# EAGLE design ELEKTRA-PMIC v0.2-Half frame shield for astellated edges adjacent-35X22 (EAGLE 9.6.2)

## Sheet 1 of 2
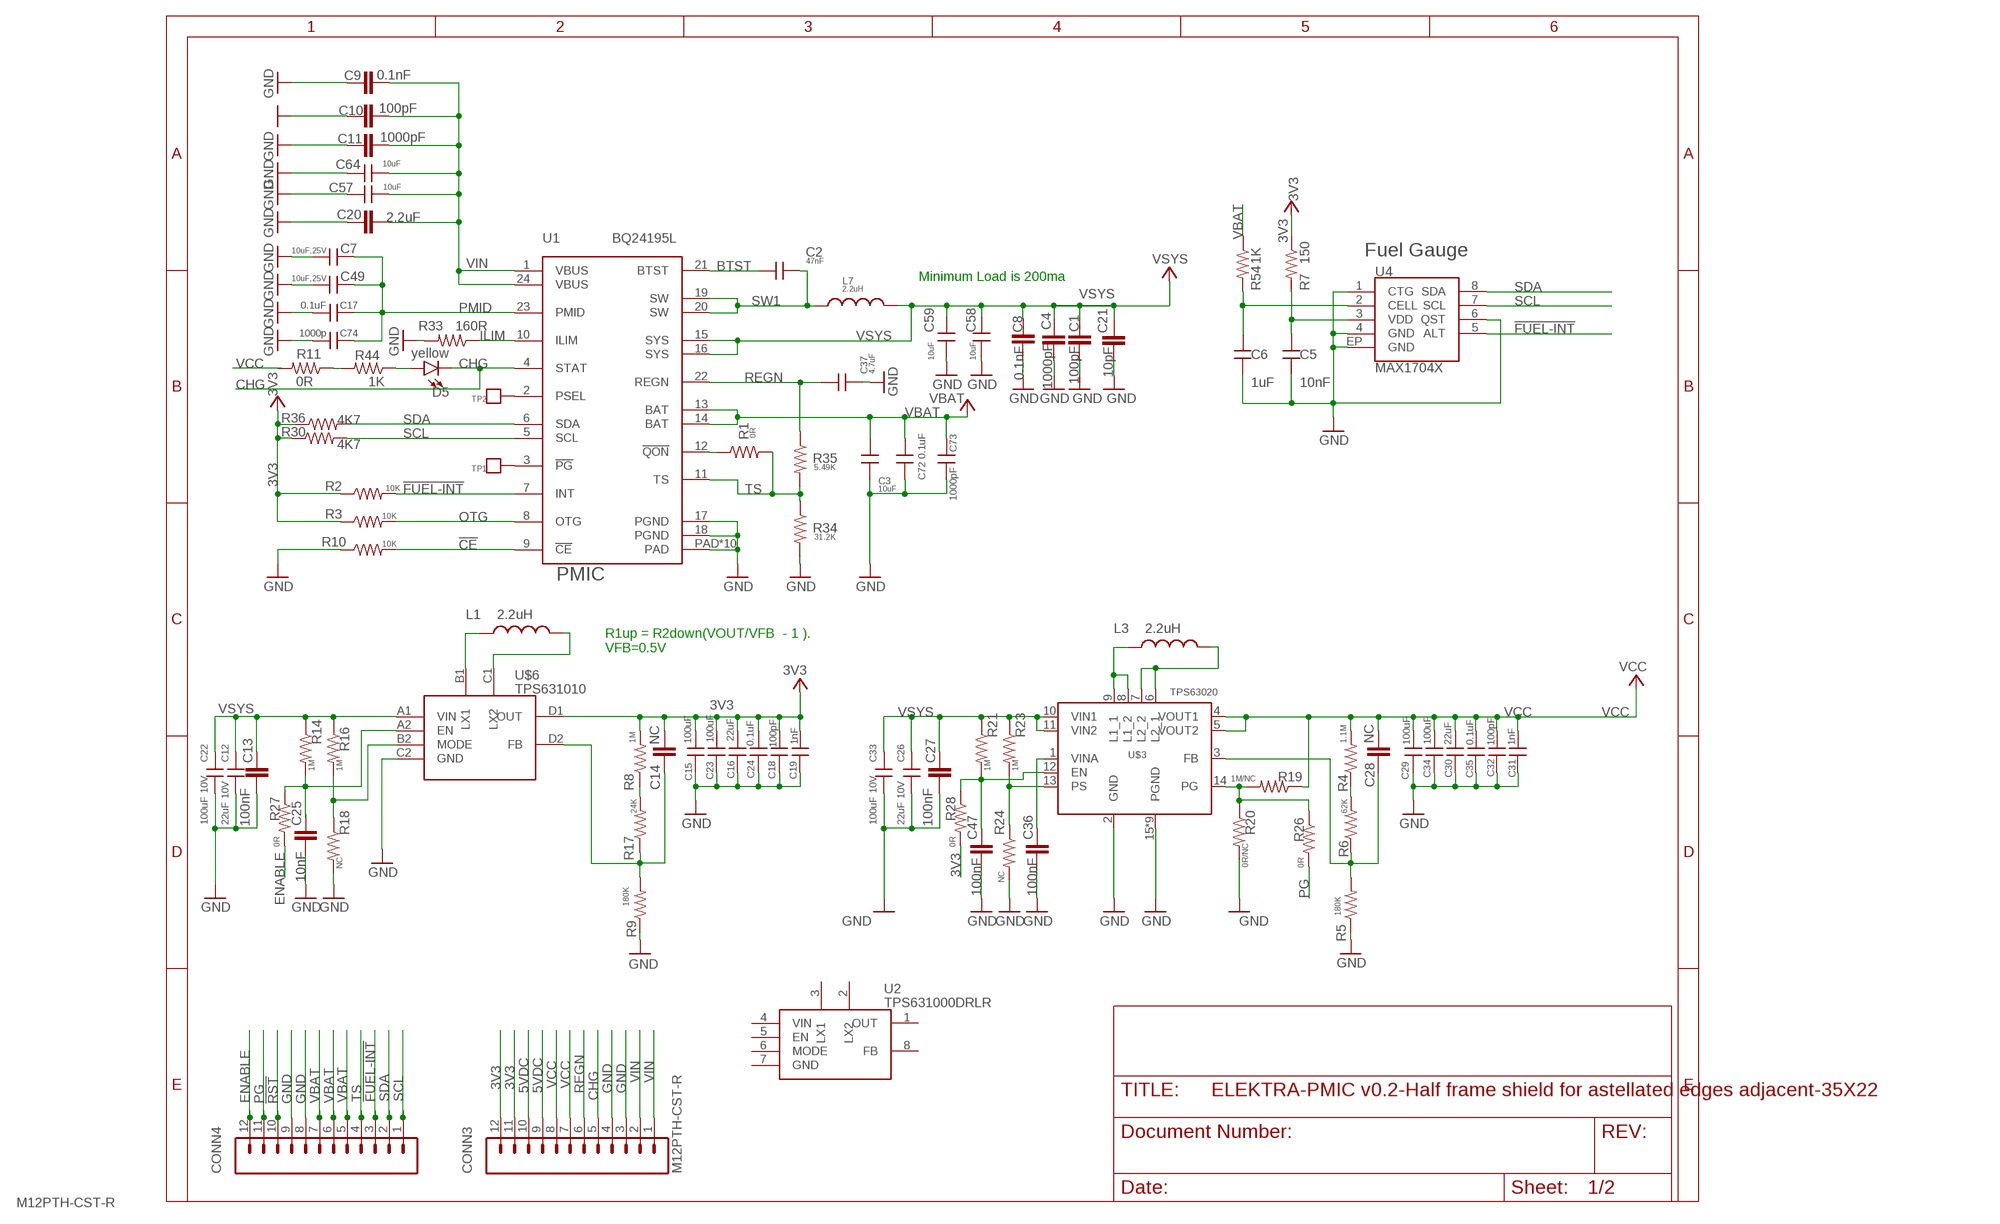
[diagram p0: schematic, sheet 1]

### Parts
C1  100pF  CAP_1  [C0402_B]
C2  47nF  CAP0402  [C-0402]
C3  10uF  CAPC0603  [C0603]
C4  1000pF  CAP_1  [C0402_B]
C5  10nF  CAP0402A  [C0402]
C6  1uF  CAP0402A  [C0402]
C7  10uF,25V  CAP0603A  [C-0603A]
C8  0.1nF  CAP_1  [C0402_B]
C9  0.1nF  CAP_1  [C0402_B]
C10  100pF  CAP_1  [C0402_B]
C11  1000pF  CAP_1  [C0402_B]
C12  22uF 10V  CAPC0805  [C0805]
C13  100nF  CAP_1  [C0402_B]
C14  NC  CAP_1  [C0402_B]
C15  100uF  CAPC1206  [C1206]
C16  22uF  CAP0603A  [C-0603A]
C17  0.1uF  CAP0402A  [C0402]
C18  100pF  CAP0402A  [C0402]
C19  1nF  CAP0402A  [C0402]
C20  2.2uF  CAP_1  [C0402_B]
C21  10pF  CAP_1  [C0402_B]
C22  100uF 10V  CAPC1206  [C1206]
C23  100uF  CAPC1206  [C1206]
C24  0.1uF  CAP0402A  [C0402]
C25  10nF  CAP_1  [C0402_B]
C26  22uF 10V  CAPC0805  [C0805]
C27  100nF  CAP_1  [C0402_B]
C28  NC  CAP_1  [C0402_B]
C29  100uF  CAPC1206  [C1206]
C30  22uF  CAP0603A  [C-0603A]
C31  1nF  CAP0402A  [C0402]
C32  100pF  CAP0402A  [C0402]
C33  100uF 10V  CAPC1206  [C1206]
C34  100uF  CAPC1206  [C1206]
C35  0.1uF  CAP0402A  [C0402]
C36  100nF  CAP_1  [C0402_B]
C37  4.7uF  CAP0402A  [C0402]
C47  100nF  CAP_1  [C0402_B]
C49  10uF,25V  CAP0603A  [C-0603A]
C57  10uF  CAP0603A  [C-0603A]
C58  10uF  CAP0603A  [C-0603A]
C59  10uF  CAP0603A  [C-0603A]
C64  10uF  CAP0603A  [C-0603A]
C72  0.1uF  CAP0402  [C-0402]
C73  1000pF  CAP0402  [C-0402]
C74  1000p  CAP0402  [C-0402]
CONN3  M12PTH-CST-R  [1X12-CASTELLATED]
CONN4  M12PTH-CST-R  [1X12-CASTELLATED]
D5  yellow  LED-RED0603  [LED-0603]
L1  2.2uH  INDUCTOR-SPARKFUNVLS3012ET-4R7M  [INDUCTOR-VLS-E]
L3  2.2uH  INDUCTOR-SPARKFUNVLS3012ET-4R7M  [INDUCTOR-VLS-E]
L7  2.2uH  INDUCTORI  [INDUCTOR-4040]
R1  0R  R-US_  [R0402_B]
R2  10K  R-US_  [R0402_B]
R3  10K  R-US_  [R0402_B]
R4  1.1M  R-US_  [R0402_B]
R5  180K  R-US_  [R0402_B]
R6  62K  R-US_  [R0402_B]
R7  150  R-US_  [R0402_B]
R8  1M  R-US_  [R0402_B]
R9  180K  R-US_  [R0402_B]
R10  10K  R-US_  [R0402_B]
R11  0R  R-US_  [R0402_B]
R14  1M  R-US_  [R0402_B]
R16  1M  R-US_  [R0402_B]
R17  24K  R-US_  [R0402_B]
R18  NC  R-US_  [R0402_B]
R19  1M/NC  R-US_  [R0402_B]
R20  0R/NC  R-US_  [R0402_B]
R21  1M  R-US_  [R0402_B]
R23  1M  R-US_  [R0402_B]
R24  NC  R-US_  [R0402_B]
R26  0R  R-US_  [R0402_B]
R27  0R  R-US_  [R0402_B]
R28  0R  R-US_  [R0402_B]
R30  4K7  R-US_  [R0402_B]
R33  160R  R-US_  [R0402_B]
R34  31.2K  R-US_  [R0402_B]
R35  5.49K  R-US_  [R0402_B]
R36  4K7  R-US_  [R0402_B]
R44  1K  R-US_  [R0402_B]
R54  1K  R-US_  [R0402_B]
TP1  TP  [TP0.7MM]
TP2  TP  [TP0.7MM]
U1  BQ24195L  BQ24298RTWR  [QFN24]
U2  TPS631000DRLR  [SOT538]
U4  MAX1704X  [TDFN-8]
U$3  TPS63020  [TPS63020]
U$6  TPS631010  [DSBGA]

### Nets
3V3: C14.2 C15.1 C16.1 C18.1 C19.1 C23.1 C24.1 CONN3.11 CONN3.12 R2.1 R3.1 R7.1 R8.2 R28.2 R30.1 R36.1 U$6.D1(OUT)
5VDC: CONN3.9 CONN3.10
!CE: R10.2 U1.9(!CE)
!FUEL-INT: CONN4.3 R2.2 U1.7(INT) U4.5(ALT)
!RST: CONN4.10
BTST: C2.1 U1.21(BTST)
CHG: CONN3.5 D5.C U1.4(STAT)
ENABLE: CONN4.12 R27.2
GND: C1.1 C3.2 C4.1 C5.2 C6.2 C7.2 C8.1 C9.1 C10.1 C11.1 C12.2 C13.1 C15.2 C16.2 C17.1 C18.2 C19.2 C20.1 C21.1 C22.2 C23.2 C24.2 C25.1 C26.2 C27.1 C29.2 C30.2 C31.2 C32.2 C33.2 C34.2 C35.2 C36.1 C37.2 C47.1 C49.2 C57.2 C58.2 C59.2 C64.2 C72.2 C73.2 C74.1 CONN3.3 CONN3.4 CONN4.8 CONN4.9 R5.1 R9.1 R10.1 R18.2 R20.2 R24.2 R33.2 R34.2 U1.17(PGND) U1.18(PGND) U1.PAD U1.PAD@1(PAD) U1.PAD@2(PAD) U1.PAD@3(PAD) U1.PAD@4(PAD) U1.PAD@5(PAD) U1.PAD@6(PAD) U1.PAD@7(PAD) U1.PAD@8(PAD) U1.PAD@9(PAD) U4.1(CTG) U4.4(GND) U4.6(QST) U4.EP(GND) U$3.2(GND) U$3.15(PGND) U$3.16(PGND) U$3.17(PGND) U$3.18(PGND) U$3.19(PGND) U$3.20(PGND) U$3.21(PGND) U$3.22(PGND) U$3.23(PGND) U$6.C2(GND)
ILIM: R33.1 U1.10(ILIM)
N$1: R1.1 U1.12(!QON)
N$2: R11.1 R44.2
N$3: D5.A R44.1
N$4: TP1.P$1 U1.3(!PG)
N$5: C14.1 R9.2 R17.1 U$6.D2(FB)
N$6: C28.1 R5.2 R6.1 U$3.3(FB)
N$7: TP2.P$1 U1.2(PSEL)
N$8: R8.1 R17.2
N$9: R4.1 R6.2
N$11: L3.P$1 U$3.8(L1_2) U$3.9(L1_1)
N$12: L1.P$1 U$6.B1(LX1)
N$14: C25.2 R14.2 R27.1 U$6.A2(EN)
N$15: R16.2 R18.1 U$6.B2(MODE)
N$16: L3.P$2 U$3.6(L2_1) U$3.7(L2_2)
N$17: L1.P$2 U$6.C1(LX2)
N$19: C36.2 U$3.1(VINA)
N$20: R19.2 R20.1 R26.1 U$3.14(PG)
N$21: C47.2 R21.2 R28.1 U$3.12(EN)
N$22: R23.2 R24.1 U$3.13(PS)
N$48: C5.1 R7.2 U4.3(VDD)
N$49: C6.1 R54.2 U4.2(CELL)
OTG: R3.2 U1.8(OTG)
PG: CONN4.11 R26.2
PMID: C7.1 C17.2 C49.1 C74.2 U1.23(PMID)
REGN: C37.1 CONN3.6 R35.1 U1.22(REGN)
SCL: CONN4.1 R30.2 U1.5(SCL) U4.7(SCL)
SDA: CONN4.2 R36.2 U1.6(SDA) U4.8(SDA)
SW1: C2.2 L7.P$1 U1.19(SW) U1.20(SW)
TS: CONN4.4 R1.2 R34.1 R35.2 U1.11(TS)
VBAT: C3.1 C72.1 C73.1 CONN4.5 CONN4.6 CONN4.7 R54.1 U1.13(BAT) U1.14(BAT)
VCC: C28.2 C29.1 C30.1 C31.1 C32.1 C34.1 C35.1 CONN3.7 CONN3.8 R4.2 R11.2 R19.1 U$3.4(VOUT1) U$3.5(VOUT2)
VIN: C9.2 C10.2 C11.2 C20.2 C57.1 C64.1 CONN3.1 CONN3.2 U1.1(VBUS) U1.24(VBUS)
VSYS: C1.2 C4.2 C8.2 C12.1 C13.2 C21.2 C22.1 C26.1 C27.2 C33.1 C58.1 C59.1 L7.P$2 R14.1 R16.1 R21.1 R23.1 U1.15(SYS) U1.16(SYS) U$3.10(VIN1) U$3.11(VIN2) U$6.A1(VIN)
Unconnected: U2.1(OUT) U2.2(LX2) U2.3(LX1) U2.4(VIN) U2.5(EN) U2.6(MODE) U2.7(GND) U2.8(FB)

### Notes on the sheet
- Fuel Gauge
- Minimum Load is 200ma
- PMIC
- R1up = R2down(VOUT/VFB  - 1 ).
  VFB=0.5V

## Sheet 2 of 2

## Library data of the parts
C1 = Particle:CAP_1; ITEM_NAME: CAP CER 100pF 50V X7R 0402 10%; ITEM_NUMBER: PT-200138
C2 = particle SZ:CAP: CAP; ITEM_NAME: CAP CER 0.1uF 16V X7R 0402 10%; ITEM_NUMBER: PT-200005
C3 C37 C58 C59 = particle SZ:CAP: CAP; ITEM_NAME: CAP CER 10uF 6.3V X5R 0603 10% Low ESR<70mohms; ITEM_NUMBER: PT-200209
C4 = Particle:CAP_1; ITEM_NAME: CAP CER 1000PF 50V X7R 0402 10%
C5 = particle SZ:CAP: CAP; ITEM_NAME: CAP CER 10nF 16V X5R 0402 10%; ITEM_NUMBER: PT-200136
C6 = particle SZ:CAP: CAP; ITEM_NAME: CAP CER X5R 1uF 0402 10V ±10% ROHS; ITEM_NUMBER: PT-200695
C7 C49 C57 C64 = particle SZ:CAP: CAP; ITEM_NAME: CAP CER 100PF 50V C0G/NP0 0603 5%; ITEM_NUMBER: PT-200458
C8 C13 C27 = Particle:CAP_1; ITEM_NAME: CAP CER 0.1UF 16V X7R 0402 10%; ITEM_NUMBER: PT-200649
C9 = Particle:CAP_1; ITEM_NAME: CAP CER 0.1UF 25V X7R 0402 20%; ITEM_NUMBER: PT-200690
C10 = Particle:CAP_1; ITEM_NAME: CAP CER 100PF 1% 50V C0G/NP0 0402; ITEM_NUMBER: 120-00051
C11 = Particle:CAP_1; ITEM_NAME: CAP CER 1000PF 50V X7R 0402 10%; ITEM_NUMBER: PT-200631
C12 C26 = particle SZ:CAP: CAP; ITEM_NAME: CAP CER 0.1UF 16V X7R 0402 10%; ITEM_NUMBER: 120-00060
C14 C25 C28 C36 C47 = Particle:CAP_1
C15 C23 C29 C34 = particle SZ:CAP: CAP; ITEM_NAME: 100UF 20% 6.3V 1206, Low DCL, ESR 0.5Ohm; ITEM_NUMBER: 120-00011
C16 C30 = particle SZ:CAP: CAP; ITEM_NAME: CAP CER 22UF 10V X5R 0603 20%; ITEM_NUMBER: 120-00061
C17 = RedBear:CAP: CAP; ITEM_NAME: CAP CER 0.1UF 25V X7R 0402 20%; ITEM_NUMBER: PT-200690
C18 C32 = particle SZ:CAP: CAP; ITEM_NAME: 100pF 50V X7R 0402 10%; ITEM_NUMBER: PT-200138
C19 C31 C73 = particle SZ:CAP: CAP; ITEM_NAME: 1000PF 50V X7R 0402 10%; ITEM_NUMBER: PT-200631
C20 = Particle:CAP_1; ITEM_NAME: CAP CER 2.2UF 25V X7S 0603; ITEM_NUMBER: PT-201241
C21 = Particle:CAP_1; ITEM_NAME: CAP CER 10PF 5% 50V C0G/NP0 0402; ITEM_NUMBER: 120-00038
C22 C33 = particle SZ:CAP: CAP
C24 C35 = particle SZ:CAP: CAP; ITEM_NAME: 0.1UF 16V X7R 0402 10%; ITEM_NUMBER: PT-200649
C72 = particle SZ:CAP: CAP; ITEM_NAME: CAP CER 0.1UF 16V X7R 0402 10%; ITEM_NUMBER: PT-200649
C74 = particle SZ:CAP: CAP; ITEM_NAME: CAP CER 1000PF 50V X7R 0402 10%; ITEM_NUMBER: PT-200631
CONN3 CONN4 = Particle:M12: Header 12 Standard 12-pin 0.1" header. Use with straight break away headers (SKU : PRT-00116), right angle break away headers (PRT-00553), swiss pins (PRT-00743), machine pins (PRT-00117), and female headers (PRT-00115).
D5 = SparkFun-LED:LED-RED: Red SMD LED Used in manufacturing of most products at SparkFun Packages: 0603 - SMD 0603 package [Product Link] <http://docs.avagotech.com/docs/AV02-0551EN> 0603 SMART - SMD 0603 SMART package ( more efficient and expensive)[Product Link] <http://www.osram-os.com/Graphics/XPic2/00077099_0.pdf> 1206 - SMD1206 package [Product Link] <https://www.sparkfun.com/datasheets/DevTools/LilyPad/Q150OVS4.pdff> SparkFun Products: Pro Mini 328 -5V <https://www.sparkfun.com/products/821> RedBoard <https://www.sparkfun.com/products/12757> IOIO-OTG <https://www.sparkfun.com/products/13613>; PROD_ID: DIO-00819; VALUE: RED
L1 L3 = Particle:INDUCTOR-SPARKFUN: Inductors Basic Inductor/Choke - 0603 and 1206. Footprints are not proven and vary greatly between part numbers. SRN6045- 33uH, 20% 1.4A
L7 = Particle:INDUCTOR; ITEM_NAME: FIXED IND 1UH 5.8A 26 MOHM SMD 4020; ITEM_NUMBER: 155-00005
R1 R26 = Spark:R-US_: 0402 Resistor; ITEM_NAME: RES SMD 0R OHM 5% 1/16W 0402; ITEM_NUMBER: PT-200624
R2 R3 R10 = Spark:R-US_: 0402 Resistor; ITEM_NAME: 10K OHM 5% 1/16W 0402; ITEM_NUMBER: PT-200004
R4-R6 R9 R18-R20 R24 R27 R28 R34 R35 = Spark:R-US_: 0402 Resistor
R7 R33 = Particle:R-US_: 0402 Resistor
R8 R14 R16 R21 R23 = Spark:R-US_: 0402 Resistor; ITEM_NAME: RES SMD 1M OHM 1% 1/16W 0402; ITEM_NUMBER: PT-201084
R11 = Particle:R-US_: 0402 Resistor; ITEM_NAME: RES SMD 0R OHM 5% 1/16W 0402; ITEM_NUMBER: PT-200624
R17 = Spark:R-US_: 0402 Resistor; ITEM_NAME: RES SMD 24K OHM 1% 1/16W 0402; ITEM_NUMBER: PT-201025
R30 R36 = Particle:R-US_: 0402 Resistor; ITEM_NAME: RES SMD 4K7 OHM 5% 1/16W 0402; ITEM_NUMBER: PT-200230
R44 R54 = Particle:R-US_: 0402 Resistor; ITEM_NAME: RES SMD 1K OHM 5% 1/16W 0402; ITEM_NUMBER: PT-200002
TP1 TP2 = Asset Tracker SoM v1.0b:TP
U1 = electron:BQ24298RTWR: Bq24298 I2C Controlled 3A Single Cell USB Charger with Narrow VDC Power Path Management and Adjustable Voltage USB OTG; ITEM_NAME: IC BATT CHG LI-ION 1CELL 24VQFN 2.5A CHG CURRENT; ITEM_NUMBER: 150-00013
U2 = particle SZ:TPS631000DRLR
U4 = SparkFun-PowerIC:MAX1704X: MAX17043/MAX17044: Battery Fuel Guage (43 is 1cell, 44 is 2cell); ITEM_NAME: IC 2-WIRE FG MODEL GAUGE LO BATT; ITEM_NUMBER: PT-200141
U$3 = particle SZ:TPS63020
U$6 = particle SZ:TPS631010

## Net classes
0 default: width 0.152 mm, drill 0.203 mm, clearance 0.152 mm
1 power: width 0.254 mm, drill 0.203 mm, clearance 0.203 mm
3 BAT: drill 0.203 mm, clearance 0.203 mm
4 3V3: width 0.305 mm, drill 0.203 mm, clearance 0.508 mm
6 +3V3: width 0.203 mm, drill 0.203 mm, clearance 0.152 mm

## Board
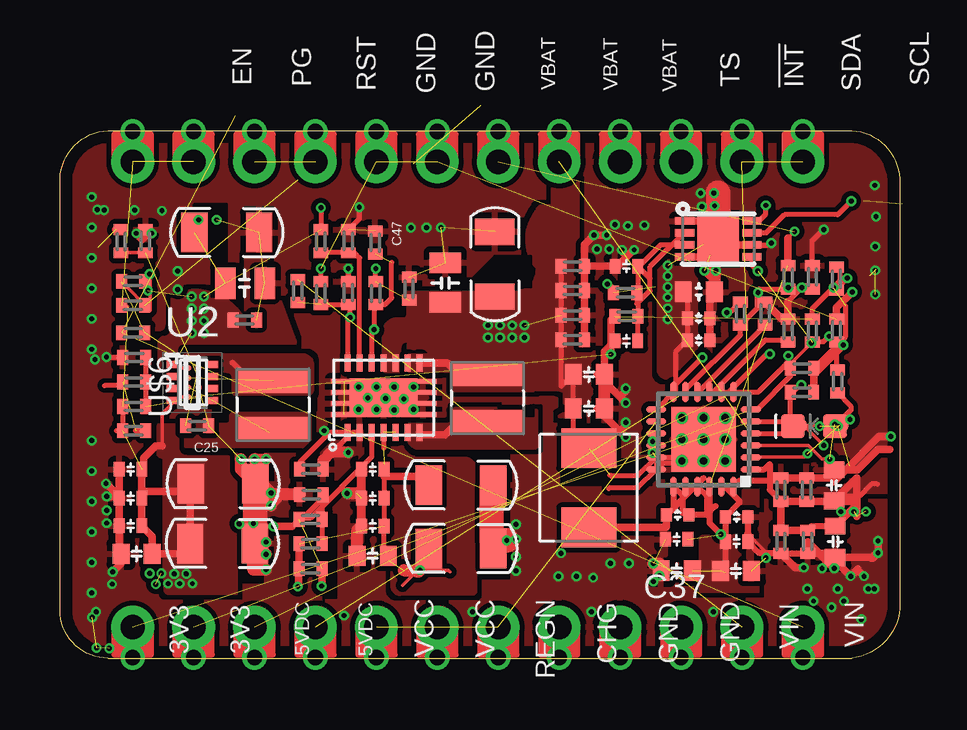
[diagram p1: board, top side]
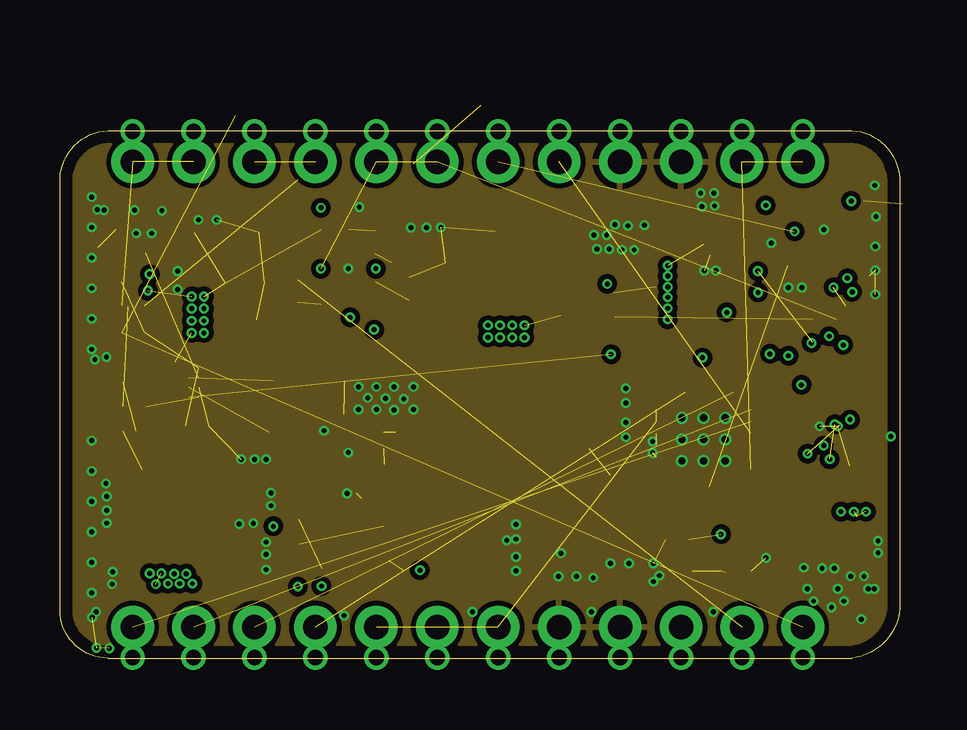
[diagram p2: board, inner layer Route2]
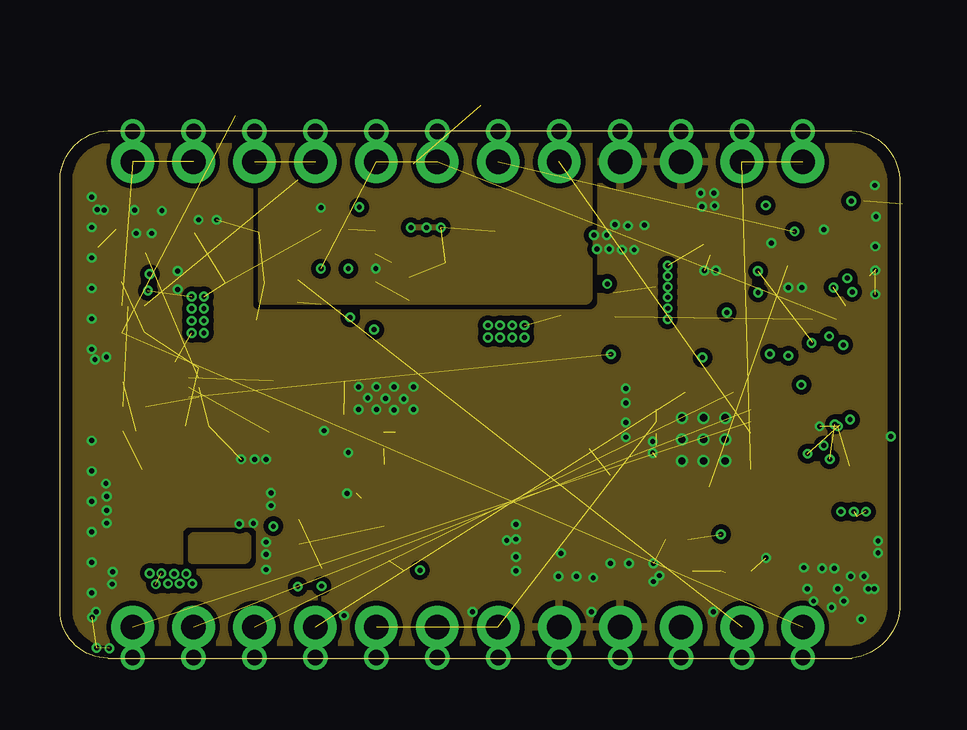
[diagram p3: board, inner layer Route15]
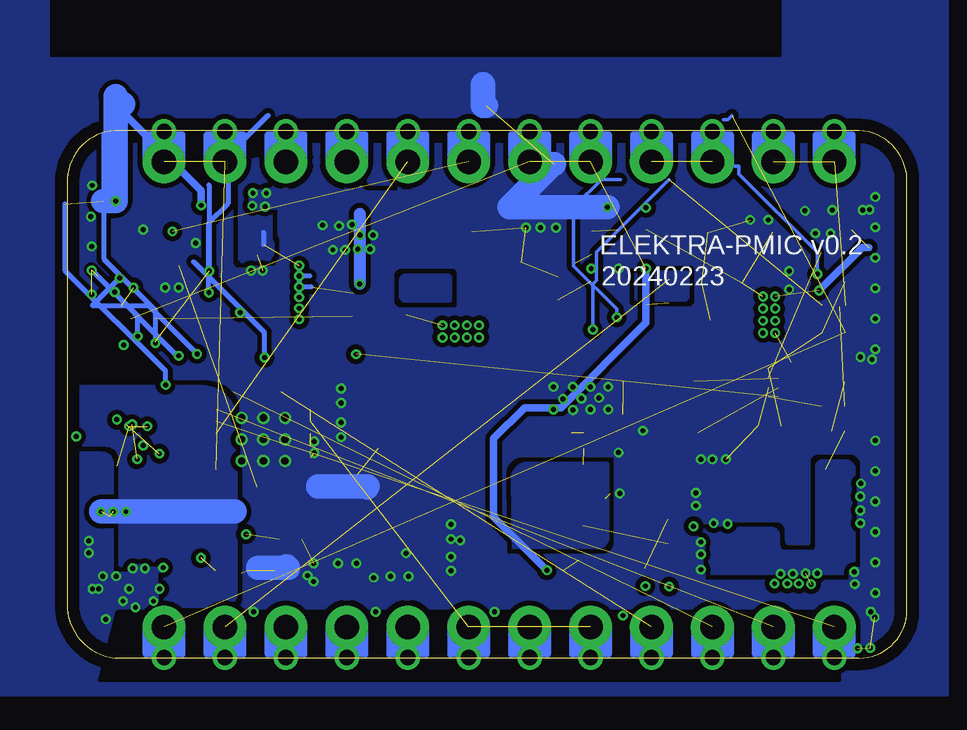
[diagram p4: board, bottom side, seen from below]

Size 35.01 x 22 mm. Coordinates in mm from the lower left corner, seen from the top.
Outline: 2,0 33,0 arc90 35,2.5 35,19.8 arc90 33,22 2,22 arc90 0,19.8 0,2 arc90 2,0
Copper layers (1+2*15+16): Top 0.035mm / dielectric 1.5mm / Route2 0.035mm / dielectric 0.15mm / Route15 0.035mm / dielectric 0.2mm / Bottom 0.035mm
Design rules "default *": minimum track width 4mil, minimum drill 8mil, track to track 8mil, track to pad 6mil, pad to pad 6mil, via to via 6mil, smd to smd 6mil, copper to edge 20mil, drill to drill 6mil, minimum pad ring 4mil, minimum via ring 4mil, stop-mask expansion 4mil, vias tented up to drill 16mil, thermal gap 10mil

### Footprints (pad centres in the part's own frame; a part is rotated, then mirrored left to right if it is on the bottom)
C0402_B = smd 0.457 x 0.61: 1 -0.483,0; 2 0.483,0
C-0402 = smd 0.45 x 0.55: 1 -0.47,0; 2 0.47,0
C0603 = smd 0.7 x 0.85: 1 -0.65,0; 2 0.65,0
C0402 = smd 0.45 x 0.6: 1 -0.47,0; 2 0.47,0
C-0603A = smd 0.7 x 0.85: 1 -0.65,0; 2 0.65,0
C0805 = smd 0.85 x 1.3: 1 -0.8,0; 2 0.85,0
C1206 = smd 1.1 x 1.65: 1 -1.35,0; 2 1.35,0
1X12-CASTELLATED = drill 1.016 pad 1.778: 1 0,-13.97; 2 0,-11.43; 3 0,-8.89; 4 0,-6.35; 5 0,-3.81; 6 0,-1.27; 7 0,1.27; 8 0,3.81; 9 0,6.35; 10 0,8.89; 11 0,11.43; 12 0,13.97 | drill 0.635 pad 1.016: @1 1.27,-13.97; @2 1.27,-11.43; @3 1.27,-8.89; @4 1.27,-6.35; @5 1.27,-3.81; @6 1.27,-1.27; @7 1.27,1.27; @8 1.27,3.81; @9 1.27,6.35; @10 1.27,8.89; @11 1.27,11.43; @12 1.27,13.97
LED-0603 = smd 1 x 1: A -0.877,0; C 0.877,0
INDUCTOR-VLS-E = smd 1 x 3: P$1 -1,0; P$2 1,0
INDUCTOR-4040 = smd 1.65 x 2.3: P$1 -1.65,0; P$2 1.65,0
R0402_B = smd 0.457 x 0.61: 1 -0.483,0; 2 0.483,0
TP0.7MM = smd 0.7 x 0.7: P$1 0,0
QFN24 = smd 0.85 x 0.28: 1 -1.975,1.25; 2 -1.975,0.75; 3 -1.975,0.25; 4 -1.975,-0.25; 5 -1.975,-0.75; 6 -1.975,-1.25; 13 1.975,-1.25; 14 1.975,-0.75; 15 1.975,-0.25; 16 1.975,0.25; 17 1.975,0.75; 18 1.975,1.25 | smd 0.28 x 0.85: 7 -1.25,-1.975; 8 -0.75,-1.975; 9 -0.25,-1.975; 10 0.25,-1.975; 11 0.75,-1.975; 12 1.25,-1.975; 19 1.25,1.975; 20 0.75,1.975; 21 0.25,1.975; 22 -0.25,1.975; 23 -0.75,1.975; 24 -1.25,1.975 | smd 2.7 x 2.7: PAD 0,0 | drill 0.3 pad 0.406: PAD@1 -0.9,0.9; PAD@2 0,0.9; PAD@3 0.9,0.9; PAD@4 -0.9,0; PAD@5 0,0; PAD@6 0.9,0; PAD@7 -0.9,-0.9; PAD@8 0,-0.9; PAD@9 0.9,-0.9
SOT538 = smd 0.475 x 0.3: 1 -0.838,0.754; 2 -0.838,0.254; 3 -0.838,-0.246; 4 -0.838,-0.746; 5 0.838,-0.746; 6 0.838,0.254; 7 0.838,-0.246; 8 0.838,0.754
TDFN-8 = smd 0.8 x 0.3: 1 -1.4,0.75; 2 -1.4,0.25; 3 -1.4,-0.25; 4 -1.4,-0.75; 5 1.4,-0.75; 6 1.4,-0.25; 7 1.4,0.25; 8 1.4,0.75 | smd 1.73 x 1.88: EP 0,0
TPS63020 = smd 0.25 x 0.7: 1 -1.5,-1.45; 2 -1,-1.45; 3 -0.5,-1.45; 4 0,-1.45; 5 0.5,-1.45; 6 1,-1.45; 7 1.5,-1.45; 8 1.5,1.45; 9 1,1.45; 10 0.5,1.45; 11 0,1.45; 12 -0.5,1.45; 13 -1,1.45; 14 -1.5,1.45 | smd 1.1 x 0.2: 15 -1.65,0.69; 16 -1.65,0.23; 17 -1.65,-0.23; 18 -1.65,-0.69; 19 1.65,-0.69; 20 1.65,-0.23; 21 1.65,0.23; 22 1.65,0.69 | smd 2.85 x 1.58: 23 0,0
DSBGA = smd 0.23 x 0.23: A1 -0.2,0.6; A2 0.2,0.6; B1 -0.2,0.2; B2 0.2,0.2; C1 -0.2,-0.2; C2 0.2,-0.2; D1 -0.2,-0.6; D2 0.2,-0.6

### Placement (x,y rotation side)
C1  21.37,15.33 180 top
C2  25.75,5.97 180 top
C3  26.63,15.28 0 top
C4  21.37,14.3 180 top
C5  23.61,13.23 180 top
C6  23.61,16.34 180 top
C7  28.18,3.64 0 top
C8  21.37,13.28 180 top
C9  31.12,7.03 270 top
C10  30.05,7.03 270 top
C11  30.05,4.86 90 top
C12  7.69,15.63 0 top
C13  7.71,14.1 180 top
C14  3.09,10.5 180 top
C15  6.8,7.27 0 top
C16  3.2,4.35 180 top
C17  28.2,4.86 180 top
C18  2.94,6.67 180 top
C19  2.94,7.88 180 top
C20  31.17,4.86 90 top
C21  21.37,16.34 180 top
C22  6.95,17.76 0 top
C23  6.78,4.78 0 top
C24  2.94,5.52 180 top
C25  5.72,9.69 180 top
C26  16.06,15.64 90 top
C27  14.56,15.41 270 top
C28  10.45,4.77 180 top
C29  16.72,4.57 0 top
C30  13.04,4.27 180 top
C31  13.04,7.88 180 top
C32  13.04,6.67 180 top
C33  18.13,16.43 90 top
C34  16.72,7.22 0 top
C35  13.04,5.51 180 top
C36  10.48,7.88 180 top
C37  25.71,4.96 180 top
C47  13.14,17.33 270 top
C49  25.71,3.65 180 top
C57  32.32,4.86 270 top
C58  22.04,10.41 0 top
C59  22.04,11.84 0 top
C64  32.27,7.21 90 top
C72  26.63,13.26 0 top
C73  26.63,14.18 0 top
C74  28.2,5.89 180 top
CONN3  17,20.7 90 top
CONN4  17,1.3 270 top
D5  31.43,9.68 180 top
L1  8.88,10.57 270 top
L3  17.81,10.85 270 top
L7  22.05,7.1 90 top
R1  28.37,14.37 270 top
R2  31.36,13.67 270 top
R3  32.37,15.83 270 top
R4  10.45,3.74 180 top
R5  10.48,6.83 0 top
R6  10.45,5.79 180 top
R7  23.61,14.25 0 top
R8  3.09,9.48 180 top
R9  3.09,12.54 0 top
R10  30.35,13.67 270 top
R11  32.37,13.67 90 top
R14  3.06,15.71 180 top
R16  2.55,17.39 270 top
R17  3.09,11.52 180 top
R18  3.56,17.39 90 top
R19  10.88,15.23 270 top
R20  12.02,15.23 90 top
R21  13.17,15.23 270 top
R23  10.88,17.39 270 top
R24  12.02,17.39 90 top
R26  9.91,15.3 90 top
R27  3.06,13.58 180 top
R28  3.06,14.71 180 top
R30  30.93,11.09 180 top
R33  29.39,14.37 90 top
R34  31.36,15.88 90 top
R35  30.35,15.88 270 top
R36  30.93,12.09 180 top
R44  32.42,11.53 90 top
R54  23.56,15.23 0 top
TP1  30.79,9.7 180 top
TP2  32.52,9.72 180 top
U1  26.83,9.12 180 top
U2  5.52,11.49 0 top
U4  27.44,17.49 0 top
U$3  13.49,10.86 0 top
U$6  5.57,11.49 0 top

### Tracks (layer width: path | path; a pad name or v marks a point on that pad's centre or on a via)
3.9V
  pour Top (no thermals): 13.47,9.77 14.13,9.77 arc-90 14.21,9.69 14.21,9.13 arc90 14.99,8.34 16.87,8.34 arc-90 17.33,7.89 17.33,2.76 arc-90 17.28,2.7 arc-90 17.23,2.65 14.18,2.65 arc-90 13.85,2.98 13.85,8.19 13.67,8.37 arc90 13.67,8.39 arc-90 13.47,8.6
3V3  (via drill 0.2 pad 0.41)  (8 unrouted)
  Top 0.152: 2.82,14.66 R28.2 | U$6.D1 4.95,10.89 4.25,10.2 4.25,8.85 4.26,8.84
  Top 0.203: C14.2 R8.2 2.35,9.48 | R2.1 31.36,14.57 v32.25,15.46 32.53,15.74 32.53,16.15 R3.1 | R30.1 R36.1 32.75,13.42 32.75,14.69
  Top 0.305: 3.41,6.95 C18.1 C24.1 3.85,5.09 C16.1 5,4.35 C23.1 5.43,7.25 C15.1 5.13,6.95 3.41,6.95 | 3.41,6.95 3.41,7.58 | 3.41,7.58 C19.1 | 3.41,7.58 3.49,7.66 3.49,8.34 3.99,8.84 4.26,8.84 | R7.1 22.97,14.09 v22.97,12.67 | v32.65,13.06 31.42,11.83 R30.1
  other vias: 5.52,3.11 4.99,3.11 4.5,3.11 4,3.09 4.22,3.54 4.76,3.52 5.27,3.52 3.74,3.54
  pour Top (no thermals): 4.15,9.74 4.86,9.74 arc-90 4.91,9.69 4.91,8.78 arc90 5.27,8.42 6.89,8.42 arc-90 7.35,7.96 7.35,2.68 4.55,2.68 arc-90 4.38,2.86 4.38,3.54 arc-90 4.35,3.57 4.35,8.24 arc90 4.2,8.39 arc-90 4.1,8.5 4.1,9.69 arc-90
  pour Route15: 5.54,3.99 7.65,3.99 arc90 7.93,4.27 7.93,5.03 arc90 7.77,5.18 5.56,5.18 arc90 5.39,5 5.39,4.14 arc90
  pour Bottom (no thermals): 2.57,8.23 3.53,8.23 arc-90 3.78,7.98 3.78,4.6 arc90 3.94,4.45 5.08,4.45 arc90 5.33,4.7 5.33,5.11 arc-90 5.64,5.41 8.36,5.41 arc-90 8.79,4.98 8.79,3.89 arc-90 8.43,3.53 2.34,3.53 arc-90 2.19,3.68 2.19,7.85 arc-90
5VDC  (1 unrouted)
!CE
  Top 0.203: U1.9 27.23,11.1 29.41,13.28 30.35,13.28 R10.2
!FUEL-INT  (via drill 0.2 pad 0.41)  (3 unrouted)
  Top 0.203: U1.7 29.11,11.1 30.37,12.36 v30.37,12.61 | v32.07,13.42 31.83,13.18 R2.2 | U4.5 28.84,16.4 v29.1,16.14
  Bottom 0.203: v32.07,13.42 32.07,14.26 33.73,15.93 | v30.37,12.61 30.42,12.61 34.01,16.2 | 29.1,19.73 v29.1,16.14
BTST
  Top 0.254: U1.21 26.97,6.76 26.97,5.98 | C2.1 26.96,5.97 27.33,6.34
CHG  (via drill 0.2 pad 0.41)  (1 unrouted)
  Top 0.152: v31.84,8.87 31.03,9.68 D5.C
  Top 0.203: U1.4 30.25,9.38 D5.C
ENABLE  (2 unrouted)
  Bottom 0.152: 7.65,22.45 7.46,22.45 7.29,22.62
GND  (via drill 0.2 pad 0.41)  (23 unrouted)
  Top 0.152: C10.1 | C74.1 28.67,5.19 29.43,4.43 v29.43,4.18 | U$3.23 13.62,10.86 13.85,11.09 U$3.21 13.37,11.09 | U$3.22 14.23,11.55 13.54,10.86 U$3.23 | U$3.17 12.48,10.63 12.53,10.68 12.53,11.24 v12.45,11.32 13.14,11.32 13.37,11.09 | U$3.23 13.37,11.09 | U$3.20 14.51,10.63 v14.33,10.81 | U$3.19 14.11,10.17 v13.93,10.35
  Top 0.203: R20.2 v12.02,16.24 | U$3.2 12.17,9.41 10.96,8.2 | 10.96,8.25 10.96,8.2 | 10.96,8.2 C36.1 | 12.54,5.49 C35.2 C32.2 12.57,6.89 | 12.57,7.76 C31.2 | 21.86,15.2 C1.1 | 27.28,15.05 C3.2 | U1.17 26.58,8.38 26.33,8.12 25.11,8.12 U1.18 | 30.35,14.88 v30.92,15.46 | R34.2 31.36,17.42 31.82,17.87 v31.84,17.87 | R24.2 12.48,18.32 v12.48,18.81 | R9.1 1.96,12.54 v1.94,12.56 | U4.6 29.65,17.24 v29.65,17.31 | 8.05,4.71 C23.2
  Top 0.254: C74.1 C17.1 29.16,4.37 C11.1 C20.1
  Top 0.305: 32.92,8.01 32.43,7.51 | 32.43,7.51 32.27,7.35 C64.2 | 32.43,7.51 C9.1 C10.1 | 24.93,3.52 C49.2 | C19.2 C18.2 | C18.2 C24.2 2.47,4.43 C16.2 2.55,3.95 v2.2,3.6 | C5.2 22.7,12.78 C59.2 22.39,11.84 23.34,10.89 | C57.2 32.16,4.37 C20.1 31.17,4.85 32.02,4 | 34.59,8.71 34.09,8.71 33.24,7.86 C64.2 | C64.2 32.75,7.86 34.14,9.24 v34.64,9.24 | C57.2 33.87,4.21 | v34.11,4.39 34.05,4.39 33.87,4.21 | 33.87,4.21 33.82,4.16 33.88,4.16 v34.11,4.38 v34.11,4.9 | C57.2 32.32,4.06 v32.96,3.42 33.27,3.73 33.27,3.67 v33.52,3.42 | R18.2 3.56,17.59 | v3.18,17.72 3.44,17.46 3.56,17.59 | 3.56,17.59 3.69,17.72 v3.82,17.72 | C18.2 2.4,6.75 v1.94,6.75 | C18.2 2.47,6.73 v1.92,7.28 | 32.02,4 v31.77,3.75 | 32.02,4 v32.27,3.75 v32.28,3.75 | v31.01,3.78 30.65,3.78 C11.1 | v23.94,17.03 23.64,16.74 | 23.64,16.74 23.14,16.24 C6.2 C21.1 | 23.64,16.74 23.43,16.95 v23.43,17.03 | C21.1 21.86,17.24 v22.26,17.64 v22.79,17.64 | C8.1 C4.1 21.86,15.2 | C1.1 C21.1 | C17.1 28.67,5.19 | 23.34,10.89 v23.59,10.64 | 23.34,10.89 23.59,11.14 v23.59,11.25 | C58.2 22.39,10.41 23.34,9.46 | 23.34,9.46 v23.59,9.21 | 23.34,9.46 23.59,9.71 v23.59,9.82 | C72.2 C73.2 27.1,14.87 27.28,15.05 | C3.2 27.28,15.75 v26.86,16.17 | 30.35,14.88 R10.1 30.09,14.15 R33.2 | C31.2 12.57,6.89 | U4.6 27.69,17.24 U4.EP | U4.4 27.02,16.74 27.09,16.8 | U4.1 27.3,18.24 27.44,18.1
  Top 0.381: C35.2 12.57,6.89 12.57,7.76
  Top 0.457: v12.02,8.57 11.28,8.57 10.96,8.25
  Top 0.508: C34.2 18.07,6.51 | v24.73,3.95 24.98,3.95 25.06,3.88 C49.2 24.95,3.65 | 12.37,6.87 v11.97,6.87 | C30.2 12.39,5.33 12.54,5.49 | R5.1 8.87,6.83 | 8.87,6.83 9.02,6.67 8.89,6.54 C15.2 | 8.87,6.83 v8.8,6.9 8.42,7.27 C15.2 | 8.8,6.45 v8.8,6.36 | C15.2 7.55,7.87 v7.55,8.29 | C15.2 8.15,8.25 v8.11,8.29 v8.59,8.29 | v8.59,4.33 8.58,4.33 C23.2 8.18,4.84 v8.59,4.84 | v8.59,3.7 8.05,3.7 8.05,4.71 | C58.2 C59.2 | U4.EP 27.28,17.32 C3.2
  Top 0.635: 18.07,6.51 C29.2
  Top 1.016: v18.63,4.92 17.99,4.92 17.99,7.14 C34.2 | C15.2 8.13,7.25 C23.2 | U4.EP 27.44,18.1 27.44,19.4 27.42,19.42
  Bottom 1.016: 22.52,7.12 22.48,7.16 24.54,7.16 | 17.54,23.04 17.68,23.04 17.68,23.93 | v12.48,18.81 16.57,18.81 14.78,20.6 14.72,20.6 | 25.87,3.83 25.81,3.76 27.05,3.76
  other vias: 13.19,11.32 13.93,11.32 14.74,11.32 12.83,10.86 13.57,10.83 12.45,10.38 13.19,10.38 14.74,10.38 1.32,19.23 1.56,18.71 1.84,18.68 3.11,18.68 4.25,18.66 1.32,17.96 1.32,16.69 1.32,15.42 1.32,14.15 1.32,12.88 1.32,9.07 1.32,7.8 1.32,6.53 1.32,5.26 1.32,3.99 1.32,2.72 31.16,2.89 32.43,2.89 33.7,2.89 1.35,1.71 1.52,0.43 2.06,0.41 31.41,2.38 32.16,2.12 32.68,2.38 33.95,2.89 33.41,1.63 23.14,18.08 1.5,1.93 11.84,1.78 17.2,1.93 22.15,1.93 27.23,1.93 4.91,15.38 4.91,16.14 8.06,5.63 5.77,18.28 6.54,18.28 1.46,12.46 24.71,9.04 24.71,8.56 24.99,3.44 24.73,3.19 22.95,3.95 32.43,9.67 20.89,4.38 23.71,3.95 31.67,9.67 7.48,5.6 11.01,9.49 19.01,5.57 19.01,4.96 19.01,4.23 19.01,3.64 2.17,3.09 22.89,17.06 22.39,17.06 23.67,18.03 24.36,18.05 27.34,16.17 30.37,15.46 26.76,18.83 27.29,18.86 26.71,19.39 27.27,19.39 1.94,6.16 1.94,5.63 14.63,17.96 15.28,17.96 15.88,17.96 20.78,3.41 21.53,3.41 22.23,3.36 33.97,19.71 34.02,18.41 33.99,17.17 33.99,16.17 33.99,15.17
  pour Bottom (rank 3): -1.7,29.34 47.42,29.34 47.42,-1.55 -1.7,-1.55
  pour Top (rank 3): -4.7,31.57 42.57,31.57 42.57,-3.81 -4.7,-3.81
  pour Route2: -3.73,30.63 44.27,30.63 44.27,-3.23 -3.73,-3.23
  cutout Top: 20.91,8.3 24.65,8.3 24.65,7.23 20.91,7.23 20.91,7.73
  cutout Top: 19.74,10.55 19.74,10.1 16.44,10.1
  cutout Top: 7.04,10.88 10.68,10.88 10.68,10.32 7.04,10.32
  cutout Top: 7.48,8.47 8.44,8.47 8.44,3.16 7.48,3.16
  cutout Top: 17.46,8.42 18.73,8.42 18.73,3.34 17.46,3.34
  cutout Bottom: 20.7,19.94 21.01,19.94 21.01,19.61 20.7,19.61
  cutout Top: 15.68,15.84 17.18,15.84 18.12,16.78 19.64,16.78 19.64,15.48 15.68,15.48
  pour Route15 (rank 3): -2.9,29.97 45.82,29.97 45.82,-2.44 -2.9,-2.44
  cutout Top: 6.33,15.07 6.33,16.57 5.57,17.33 5.57,18.88 5.62,18.93 6.94,18.93 6.94,15.1 6.92,15.07
  cutout Top: 10.52,15.48 10.52,15.05 11.18,15.05 11.18,15.48
  cutout Top: 10.98,5.98 10.98,2.52 11.51,2.52 11.51,5.98
  cutout Bottom: 2.79,1.96 32.92,1.96 32.94,1.93 33.68,-0.91 32.94,-0.91 2.79,-0.91
  cutout Bottom: 5.31,28.07 5.31,25.12 35.66,25.12 35.66,28.07
ILIM
  Top 0.203: U1.10 26.62,11.1 29.39,13.87 R33.1
N$1  (via drill 0.2 pad 0.41)
  Top 0.203: v26.78,12.53 25.58,11.33 U1.12 | R1.1 27.93,14.41 v27.8,14.41
  Bottom 0.203: 29.06,15.85 27.8,14.59 v27.8,14.41 | 29.74,16.54 26.78,13.58 v26.78,12.53
N$2
  Top 0.203: R44.2 32.37,12.06 R11.1
N$3
  Top 0.203: R44.1 32.98,10.49 32.98,10.35 D5.A
N$4  (via drill 0.2 pad 0.41)  (1 unrouted)
  Top 0.152: TP1.P$1 32.25,9.7 v32.3,9.75 | v32.09,8.3 31.77,8.3 31.2,8.88 U1.3
N$5  (1 unrouted)
  Top 0.203: 3.57,12.76 R9.2 R17.1 C14.1
N$6
  Top 0.203: U$3.3 13,8.39 10.44,5.83 10.11,5.83 10.96,6.68 R5.2 10.93,6.8 R6.1 C28.1
N$7  (via drill 0.2 pad 0.41)  (1 unrouted)
  Top 0.152: U1.2 28.83,8.4 31.04,8.4 v31.17,8.53 | v32.94,9.95 32.71,9.72 TP2.P$1
N$8  (1 unrouted)
  Top 0.203: R8.1 3.15,9.48 | R17.2 2.46,11.37 1.86,11.37
N$9  (via drill 0.2 pad 0.41)  (1 unrouted)
  Top 0.203: R6.2 9.68,5.5
  Top 0.305: 9.68,5.5 v8.9,5.5 | R4.1 10.93,3.04 v10.91,3.01
N$11
  Top 0.305: L3.P$1 16.62,11.85 16.16,12.31 U$3.8
  pour Top (no thermals): 14.59,12.66 19.67,12.66 arc-90 19.82,12.51 19.82,11.29 arc-90 19.67,11.14 16.52,11.14 arc-90 16.37,11.29 16.37,11.85 arc90 16.26,11.95 14.59,11.95 arc-90 14.54,12 14.54,12.61 arc-90
N$12  (1 unrouted)
  Top 0.254: L1.P$1 7.93,11.57 7.19,12.31
  pour Top (no thermals): 5.19,12.66 10.12,12.66 arc-90 10.52,12.25 10.52,11.19 arc-90 10.32,10.98 7.32,10.98 arc-90 7.22,11.09 7.22,11.7 arc90 6.97,11.95 5.19,11.95
N$14  (via drill 0.2)  (3 unrouted)
  Top 0.152: R14.2 3.76,14.5 3.76,16.03 v3.74,16.01
  Bottom 0.152: 7.7,20.52 7.01,20.52 7.01,20.19 3.74,16.93 v3.74,16.01
N$15  (1 unrouted)
  Top 0.152: R16.2 R18.1
N$16
  Top 0.305: L3.P$2 16.6,9.85 16.06,9.31 15.1,9.31 U$3.7
  pour Top (no thermals): 14.54,9.77 16.16,9.77 arc90 16.42,10.02 16.42,10.32 arc-90 16.52,10.43 19.72,10.43 arc-90 19.87,10.27 19.87,8.85 arc-90 19.77,8.75 14.94,8.75 arc-90 14.54,9.16
N$17  (1 unrouted)
  Top 0.305: L1.P$2 8.72,9.41
  pour Top (no thermals): 5.24,9.77 6.97,9.77 arc90 7.12,9.92 7.12,10.12 arc-90 7.22,10.22 10.22,10.22 arc-90 10.42,10.02 10.42,8.95 arc-90 10.27,8.8 5.24,8.8
N$19
  Top 0.203: U$3.1 11.23,9.41 9.99,8.17 C36.2
N$20  (via drill 0.2)  (1 unrouted)
  Top 0.203: R19.2 R20.1 12.1,14.67 v12.1,14.21 12,14.11 U$3.14
  Bottom 0.152: 11.94,19.96 12.73,19.96 13.89,18.8 13.89,16.36 12.1,14.56 v12.1,14.21
N$21  (via drill 0.2)  (2 unrouted)
  Top 0.203: U$3.12 13,13.6 v13.1,13.7 13.1,14.74 R21.2 13.55,14.74 13.83,15.02 13.83,16.5
  Bottom 0.152: 9.93,19.96 12.95,16.94 12.95,15.74 13.1,15.6 v13.1,13.7
N$22
  Top 0.203: R23.2 R24.1 12.29,16.9 12.5,16.69 U$3.13
N$48
  Top 0.203: U4.3 25.04,17.24 24.1,16.29 R7.2 24.1,13.23 C5.1
N$49
  Top 0.203: R54.2 24.05,14.78 24.6,15.33 24.6,15.83 | 24.6,15.83 24.6,16.33 26,17.74 U4.2 | 24.6,15.83 C6.1
OTG  (via drill 0.2 pad 0.41)
  Top 0.203: v32.83,15.84 32.37,15.38 R3.2 | U1.8 27.88,11.1 29.47,12.69 v29.6,12.69
  Bottom 0.203: v29.6,12.69 31.62,14.71 33.96,14.71 v32.83,15.84
PG  (1 unrouted)
PMID  (2 unrouted)
  Top 0.254: U1.23 27.74,7.15 28.33,6.55 28.33,6.49 C74.2 C17.2 27.73,3.56
  Top 0.305: C49.1 26.23,3.52
  pour Top (no thermals): 28.49,9.09 28.65,9.09 28.65,8.27 arc90 28.93,7.99 arc-90 29.1,7.81 29.1,2.76 26.69,2.76 26.69,4.96 arc-90 26.82,5.09 27.96,5.09 arc90 28.49,5.63
REGN  (via drill 0.2 pad 0.41)  (3 unrouted)
  Top 0.152: 30.35,17.52 v30.62,17.79
  Top 0.254: v27.55,5.17 27.08,5.64 U1.22
  Top 0.305: R35.1 30.35,17.52
  Bottom 0.203: v30.62,17.79 30.62,17.74
SCL  (via drill 0.2 pad 0.41)  (2 unrouted)
  Top 0.152: v30.91,11.4 30.6,11.09 R30.2
  Top 0.203: U1.5 30.2,9.88 30.45,10.13 R30.2 | U4.7 29.45,17.74 30.2,18.49 32.42,18.49 v32.99,19.06
  Bottom 0.203: v30.91,11.4 30.91,11.97 35.11,16.17 35.11,18.94
  Bottom 1.016: 32.99,23.43 v32.99,19.06 33.51,19.06
SDA  (via drill 0.2 pad 0.41)  (1 unrouted)
  Top 0.152: R36.2 30.45,12.27 v31.33,13.14
  Top 0.203: R36.2 30.45,11.76 29.06,10.38 U1.6 | U4.8 29.14,18.24 29.43,18.52 v29.43,18.88
  Bottom 0.203: v31.33,13.14 31.33,14.5 33.48,16.65 33.48,21.83 32.69,22.62 32.69,23.09
  Bottom 0.305: v29.43,18.88 29.43,19.49 32.69,22.76 32.69,23.09
  Bottom 1.016: 32.68,23.1 32.69,23.09
SW1
  Top 0.254: L7.P$1 23.94,5.45 | C2.2 25.31,5.97 25.95,6.61 | 25.95,6.05 25.95,6.78 U1.19 25.58,6.26 26.83,7.51 | U1.20 26.47,7.15
  Top 0.305: C2.2 25.28,5.48 25.25,5.45 L7.P$1
TS  (via drill 0.2 pad 0.41)  (1 unrouted)
  Top 0.203: U1.11 26.08,11.2 28.37,13.48 R1.2 29.08,14.6 29.08,15.22 | R34.1 R35.2 29.14,15.4 29.08,15.34 29.08,15.22 | 29.08,15.22 v29.1,15.25
  Bottom 0.203: v29.1,15.25 29.1,18.16 28.3,18.96 28.3,20.97 26.62,22.64
VBAT  (via drill 0.2 pad 0.41)  (6 unrouted)
  Top 0.203: C3.1 26.16,15.1 C73.1 C72.1 25.66,12.76 25.66,11.18 U1.13
  Top 0.305: R54.1 23.08,15.35 v22.82,15.61
  Bottom 0.203: 24.9,15.94 v25.34,15.94 | 26.82,17.75 26.82,17.25 | 24.83,15.48 v25.34,15.48 | v25.34,16.37 v25.34,15.05
  Bottom 0.508: 22.82,18.53 v22.82,15.61
  other vias: 25.34,14.59 25.34,14.13
  pour Top (no thermals): 25.56,17.31 26.53,17.31 26.53,11.72 arc-90 26.45,11.65 25.36,11.65 arc-90 24.94,12.07 24.94,16.68 arc-90
  pour Bottom (no thermals): 24.66,20.8 27.08,20.8 arc-90 27.84,20.04 27.84,16.74 arc-90 27.58,16.48 26.75,16.48 arc-90 26.49,17.45 26.49,18.47 arc90 26.19,18.77 24.66,18.77 arc-90 24.54,18.9 24.54,20.68 arc-90
VCC  (via drill 0.2 pad 0.41)  (7 unrouted)
  Top 0.152: 16.26,3.59 16.19,3.67 v15.01,3.67 14.95,3.61 | 14.87,3.61 14.29,3.03
  Top 0.203: R19.1 v10.88,16.24 | U$3.4 13.5,8.75 | 13.51,8.08 C31.1 13.51,7.58 C32.1 C35.1 13.51,4.45 C30.1 13.69,4.15 13.69,4.08
  Top 0.305: R11.2 32.37,14.61 v33.03,15.27 | C34.1 15.37,7.58 13.51,7.58 | 13.73,4.2 13.69,4.15 | C28.2 R4.2 9.94,3.71 9.94,3.01 v9.91,2.98
  Top 0.508: C29.1 15.37,4.03 14.95,3.61 14.87,3.61 | 14.33,3.67 v15.01,3.67
  Bottom 0.305: v10.88,16.24 10.88,13.99 14.43,10.44 15.95,10.44 17.24,9.15 17.24,5.9 v15.01,3.67
  pour Bottom (no thermals): 12.47,8.13 15.82,8.13 arc-90 16.46,7.49 16.42,4.6 12.88,4.61 arc-90 12.47,5.02
VIN  (via drill 0.2 pad 0.41)  (4 unrouted)
  Top 0.203: 34.08,7.26 33.83,7.26 33.32,6.75 32.46,6.75 C64.1
  Top 0.254: U1.24 28.33,7.4 29.59,7.4 | C10.2 30.05,6.55 29.59,7.02 29.59,7.4 | U1.1 29.37,7.88 29.59,8.1 29.59,7.4 | C20.2 31.34,5.51 C57.1
  Top 0.305: 33.23,6.54 C9.2 C10.2 C11.2 C20.2 | C64.1 33.23,7.52 33.23,6.54 | C57.1 33.23,6.42 | 33.23,5.92 33.23,6.42 | 33.23,6.42 33.23,6.54
  Bottom 1.016: 28.04,6.11 v33.6,6.11
  other vias: 33.09,6.11 32.56,6.11
  pour Top (no thermals): 29.46,9.52 30.22,9.52 arc-90 30.32,9.42 30.32,8.81 arc90 30.45,8.68 34.53,8.68 arc-90 34.84,8.38 34.84,7.08 arc-90 34.66,6.9 30.6,6.9 arc-90 30.5,7 30.5,8.14 arc90 30.3,8.35 29.1,8.35 arc-90 28.98,8.47 28.98,9.06 29.43,9.06 arc90 29.46,9.09
  pour Bottom (no thermals): 36.78,11.35 29.44,11.35 arc90 27.97,9.88 27.97,2.72 arc90 28.55,2.13 31.7,2.13 arc90 32.79,3.23 32.79,8.28 arc-90 33.38,8.86 36.83,8.86 arc90 37.72,9.75 37.72,10.01 37.72,10.41 arc90
VSYS  (via drill 0.2 pad 0.41)  (10 unrouted)
  Top 0.152: 4.81,12.36 5.08,12.09 U$6.A1
  Top 0.203: R21.1 v13.17,16.24 | v10.88,18.78 R23.1 | C21.2 C1.2 C4.2 C8.2 20.89,11.33 C59.1 C58.1 21.4,9.41 L7.P$2 | U1.15 24.86,8.37 24.08,7.59 22.97,7.59 22.93,7.64 | U1.16 24.86,7.87 24.08,7.09 22.89,7.09 22.88,7.08
  Top 0.305: R14.1 3.67,15.62 v3.67,15.33 | R16.1 2.32,17.87
  Bottom 0.203: v17.84,13.88 17.79,13.83
  Bottom 0.305: 1.58,17.13 1.86,17.13 v3.67,15.33
  other vias: 5.49,13.56 5.49,14.07 5.49,14.58 5.49,15.08 6,13.56 6,14.07 6,14.58 6,15.08 18.35,13.88 18.86,13.88 19.36,13.88 17.84,13.37 18.35,13.37 18.86,13.37 19.36,13.37
  pour Top (no thermals): 26.58,11.33 26.58,10.92 arc-90 26.27,10.62 21.04,10.62 21.04,15.04 arc-90 20.53,15.54 20.53,20.98 arc-90 20.98,21.44 21.23,21.44 21.59,21.44 21.59,16.46 arc90 21.75,16.31 22.51,16.31 arc-90 22.76,16.05 22.76,13.21 arc90 23.12,12.85 24.64,12.85 arc-90 24.79,12.7 24.79,11.48 arc90 24.95,11.33
  pour Top (no thermals): 13.47,13.58 13.47,12.05 arc90 13.57,11.95 14.18,11.95 14.18,12.97 arc-90 14.44,13.22 19.46,13.22 arc90 19.77,13.52 19.77,15.1 14.7,15.1 arc90 14.5,14.9 14.5,14.35 arc-90 14.28,14.13 14.03,14.13 arc90
  pour Top (no thermals): 4.65,15.1 4.65,13.69 arc-90 4.33,13.37 arc90 4.12,13.17 4.12,12.1 arc90 4.28,11.95 4.83,11.95 arc90 4.86,11.98 4.86,12.84 arc-90 5.16,13.14 9.84,13.14 7.72,18.96 7.72,14.05 arc90
  pour Route15: 8.31,21.92 8.31,14.94 arc90 8.43,14.81 21.9,14.81 arc90 22.15,15.06 22.15,21.67 arc90 21.77,22.05 8.43,22.05 arc90
  pour Top (no thermals): 21.24,18.86 20.07,18.86 arc90 19.9,16.24 19.9,18.68 19.9,15.99 arc90 20.13,15.76 arc-90 20.43,15.46 20.43,15.33 arc-90 20.46,15.35 21.5,15.35 arc90 21.52,15.38 21.52,18.58 arc90
  pour Bottom: 9.2,16.1 11.15,16.1 arc-90 11.33,15.93 11.33,15.04 arc-90 11.23,14.94 9.25,14.94 arc-90 9.12,15.06 9.12,16.03 arc-90
  pour Bottom: 21.36,21.89 22.38,21.89 arc-90 22.48,21.79 22.48,19.96 arc-90 22.28,19.76 21.34,19.76 arc-90 21.13,19.96 21.13,21.67 arc-90
  pour Bottom: 19.13,15.98 20.9,15.98 arc-90 21.13,15.75 21.13,15.11 arc-90 20.9,14.88 19.08,14.88 arc-90 19,14.96 19,15.85 arc-90
  pour Top (no thermals): 20.79,10.08 21.38,10.08 arc90
  pour Top (no thermals): 14.51,15.28 18.96,15.28 arc90 19.9,16.22 19.9,18.68 arc-90 20.07,18.86 21.32,18.86 21.32,10.65 arc-90 21.14,10.48 21.14,10.78 arc90 20.73,11.19 14.54,11.19 14.54,15.25 arc90

### Text on the board
Top: T1
Route2: G2
Route15: P3
Bottom: B4
tPlace: EN | PG | RST | GND | GND | VBAT | VBAT | VBAT | TS | !INT | SDA | SCL | 3V3 | 3V3 | 5VDC | 5VDC | VCC | VCC | CHG | GND | GND | VIN | VIN | REGN
bPlace: ELEKTRA-PMIC v0.2 | 20240223
Reference: 40*27mm
tDocu: NR3015T2R2M